# EAGLE design Thermocouple Testing (EAGLE 9.5.0)
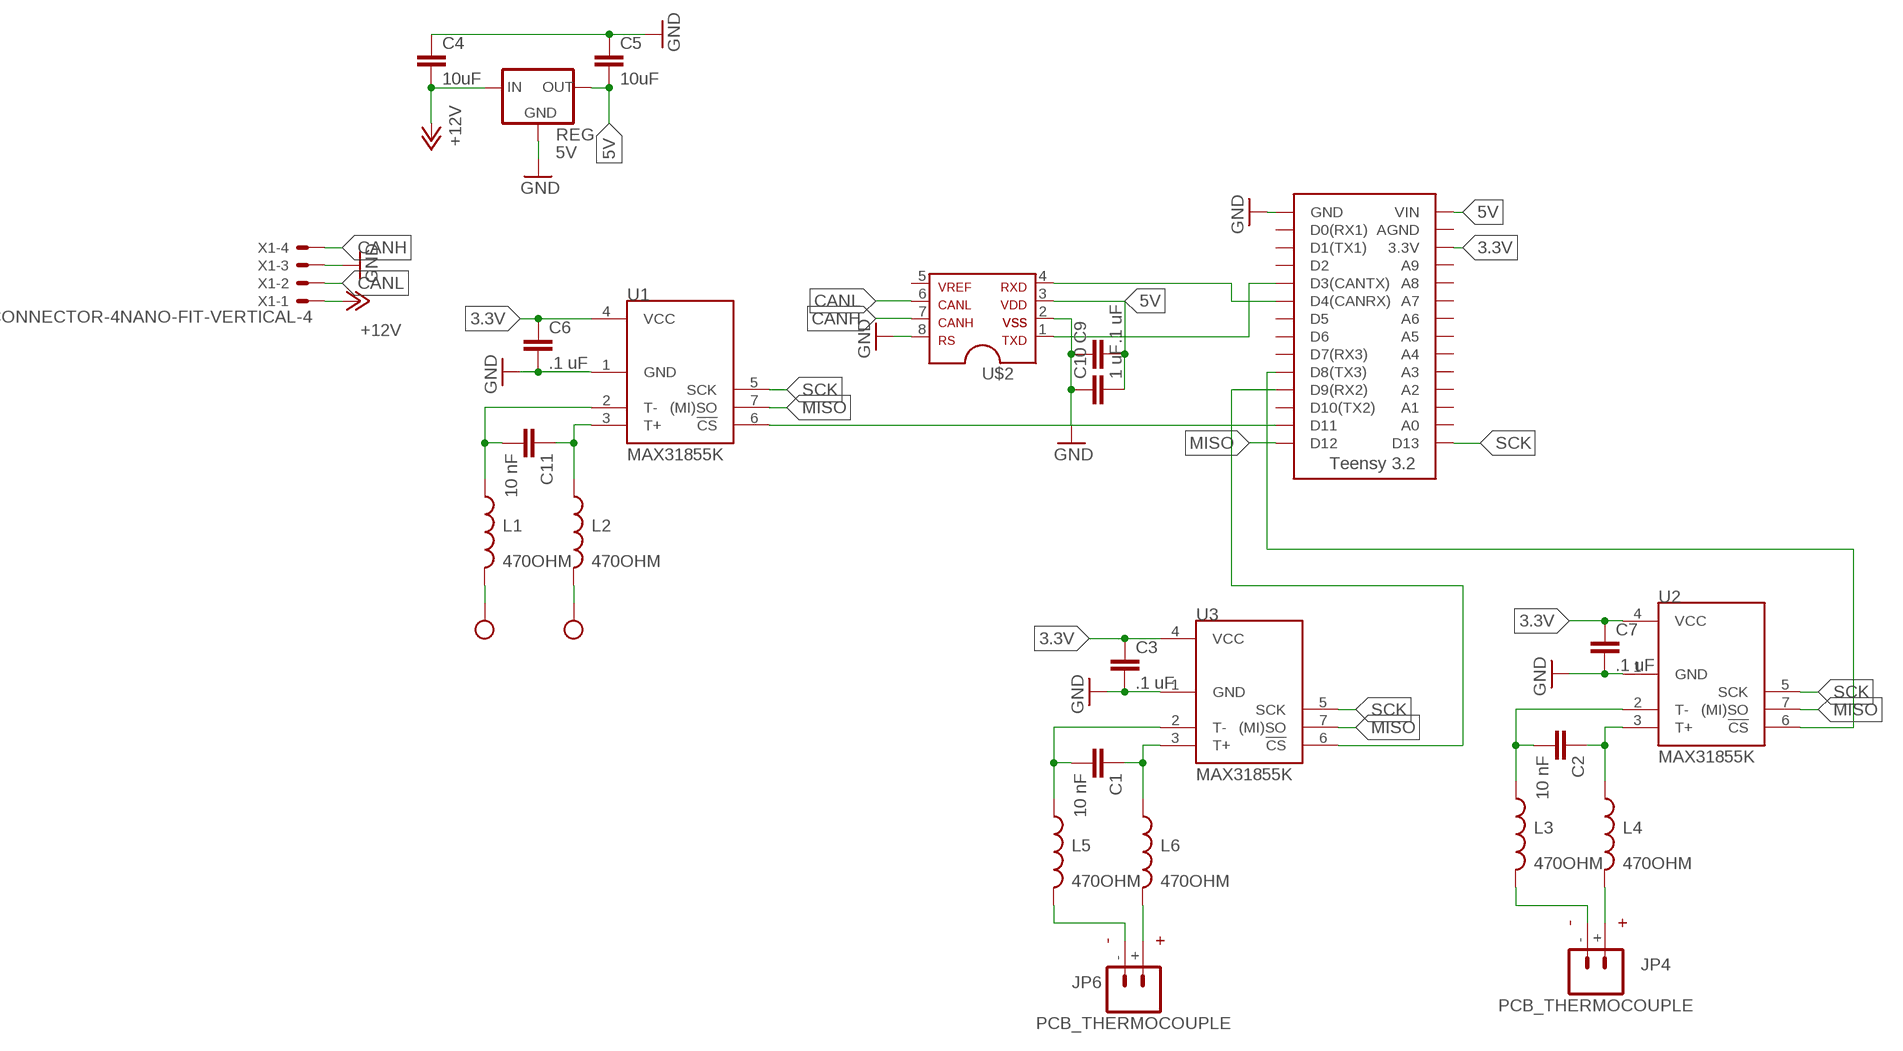
[diagram p0: schematic, sheet 1]

## Parts
C1  10 nF  CAP_  [AXIAL-5MM]
C2  10 nF  CAP_  [AXIAL-5MM]
C3  .1 uF  CAP_  [AXIAL-5MM]
C4  10uF  CAP_  [AXIAL-5MM]
C5  10uF  CAP_  [AXIAL-5MM]
C6  .1 uF  CAP_  [AXIAL-5MM]
C7  .1 uF  CAP_  [AXIAL-5MM]
C9  .1 uF  CAP_  [AXIAL-5MM]
C10  1 uF  CAP_  [AXIAL-5MM]
C11  10 nF  CAP_  [AXIAL-5MM]
JP4  PCB_THERMOCOUPLE  [PCC-SMP]
JP6  PCB_THERMOCOUPLE  [PCC-SMP]
L1  470OHM  INDUCTOR0805  [0805]
L2  470OHM  INDUCTOR0805  [0805]
L3  470OHM  INDUCTOR0805  [0805]
L4  470OHM  INDUCTOR0805  [0805]
L5  470OHM  INDUCTOR0805  [0805]
L6  470OHM  INDUCTOR0805  [0805]
REG  5V  OKI-78SR-5  [OKI-78SR]
U1  MAX31855K  [SOIC8]
U2  MAX31855K  [SOIC8]
U3  MAX31855K  [SOIC8]
U$1  TEENSY_3.2_SIMPLE  [TEENSY_3.2_SIMPLE]
U$2  MCP2551DIL  [DIL08]
U$3  TEST_POINT  [TEST_POINT]
U$4  TEST_POINT  [TEST_POINT]
X1  CONNECTOR-4NANO-FIT-VERTICAL-4  [NANO-FIT_VERTICAL-4]

## Nets
3.3V: C3.P$1 C6.P$1 C7.P$1 U1.4(VCC) U2.4(VCC) U3.4(VCC) U$1.3.3V
5V: C5.P$2 C9.P$2 C10.P$2 REG.3(OUT) U$1.VIN U$2.3
+12V: C4.P$2 REG.1(IN) X1.P$1
CANH: U$2.7 X1.P$4
CANL: U$2.6 X1.P$2
GND: C3.P$2 C4.P$1 C5.P$1 C6.P$2 C7.P$2 C9.P$1 C10.P$1 REG.2(GND) U1.1(GND) U2.1(GND) U3.1(GND) U$1.GND U$2.2 U$2.8 X1.P$3
MISO: U1.7((MI)SO) U2.7((MI)SO) U3.7((MI)SO) U$1.D12
N$1: L1.2 U$3.P$1
N$2: L2.2 U$4.P$1
N$3: C11.P$2 L1.1 U1.2(T-)
N$6: C2.P$1 L4.1 U2.3(T+)
N$7: C11.P$1 L2.1 U1.3(T+)
N$8: U1.6(!CS) U$1.D11
N$10: U3.6(!CS) U$1.D9(RX2)
N$11: U2.6(!CS) U$1.D8(TX3)
N$12: C2.P$2 L3.1 U2.2(T-)
N$13: JP4.- L3.2
N$14: JP4.+ L4.2
N$15: C1.P$1 L6.1 U3.3(T+)
N$16: U$1.D3(CANTX) U$2.1
N$17: U$1.D4(CANRX) U$2.4
N$19: C1.P$2 L5.1 U3.2(T-)
N$20: JP6.- L5.2
N$21: JP6.+ L6.2
SCK: U1.5(SCK) U2.5(SCK) U3.5(SCK) U$1.D13
Unconnected: JP4.CLIP1 JP4.CLIP2 JP6.CLIP1 JP6.CLIP2 U$1.A0 U$1.A1 U$1.A2 U$1.A3 U$1.A4 U$1.A5 U$1.A6 U$1.A7 U$1.A8 U$1.A9 U$1.AGND U$1.D0(RX1) U$1.D1(TX1) U$1.D2 U$1.D5 U$1.D6 U$1.D7(RX3) U$1.D10(TX2) U$2.5

## Library data of the parts
C1-C7 C9-C11 = HyTechDevices:CAP: Capacitor Standard 0603 ceramic capacitor, and 0.1" leaded capacitor.
JP4 JP6 = Testing:PCB_THERMOCOUPLE: Circuit Board Thermocouple Connectors Glass-Filled Nylon 220°C (425°F) The PCC connector from OMEGA is perfect for bringing thermocouple probes to printed circuit boards. (OMEGA PCC-SMP) For type-k thermocouples.
L1-L6 = SparkFun-Passives:INDUCTOR: Inductors Basic Inductor/Choke - 0603 and 1206. Footprints are not proven and vary greatly between part numbers. INDUCTOR POWER 3.3UH 4.0A SMD 0.197" L x 0.197" W x 0.177" H (5.00mm x 5.00mm x 4.50mm); PROD_ID: NDUC-12579
REG = HyTechDevices:OKI-78SR-5: Murata OKI-78SR 5V 1.5A Non-Isolated Switching Regulator DC/DC - Datasheet <https://power.murata.com/data/power/oki-78sr.pdf>
U1-U3 = SparkFun-AnalogIC:MAX31855K: Cold-Junction-Compensated K-Thermocoupleto-Digital Converter (-270°C to +1800°C) The MAX31855K performs cold-junction compensation and digitizes the signal from a type-K thermocouple. The data is output in a 14-bit resolution, SPI™-compatible, read-only format. This converter resolves temperatures to 0.25°C, allows readings as high as +1800°C and as low as -270°C, and exhibits thermocouple accuracy of ±2°C for temperatures ranging from -200°C to +700°C for K-type thermocouples.; PROD_ID: IC-12578
U$1 = HyTechDevices:TEENSY_3.2_SIMPLE: Simple version of the Teensy 3.2 board that only uses the 2 main rows of pins, not the inner pins or the pins opposite the usb port.
U$2 = HyTechDevices:MCP2551: MCP2551 High-Speed CAN Transceiver Product Webpage <https://www.microchip.com/wwwproducts/en/MCP2551> Datasheet <http://ww1.microchip.com/downloads/en/DeviceDoc/21667f.pdf> This device is outdated It is replaced by MCP2561. Comparison Page <https://www.microchip.com/wwwproducts/ProductCompare/MCP2551/MCP2561> Product Webpage <https://www.microchip.com/wwwproducts/en/MCP2561> Datasheet <http://ww1.microchip.com/downloads/en/DeviceDoc/20005167C.pdf>
U$3 U$4 = HyTechDevices:TEST_POINT: Keystone Electronics Test Point 5005
X1 = HyTechDevices:CONNECTOR-4: Mini-Fit Junior connector 4 pole Source: http://www.molex.com

## Board
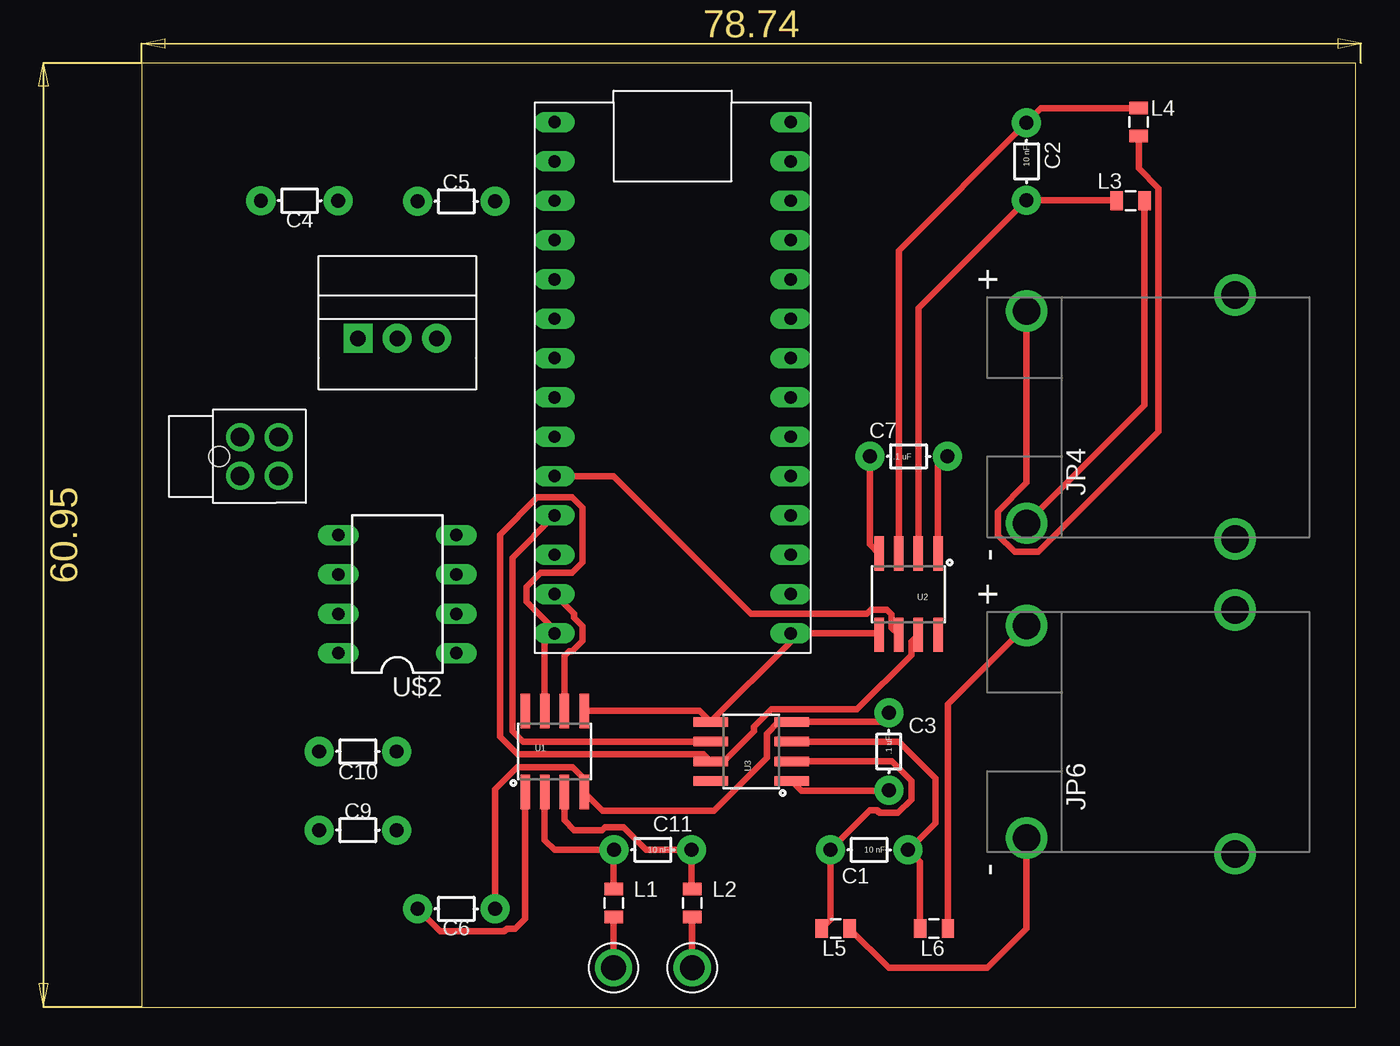
[diagram p1: board, top side]
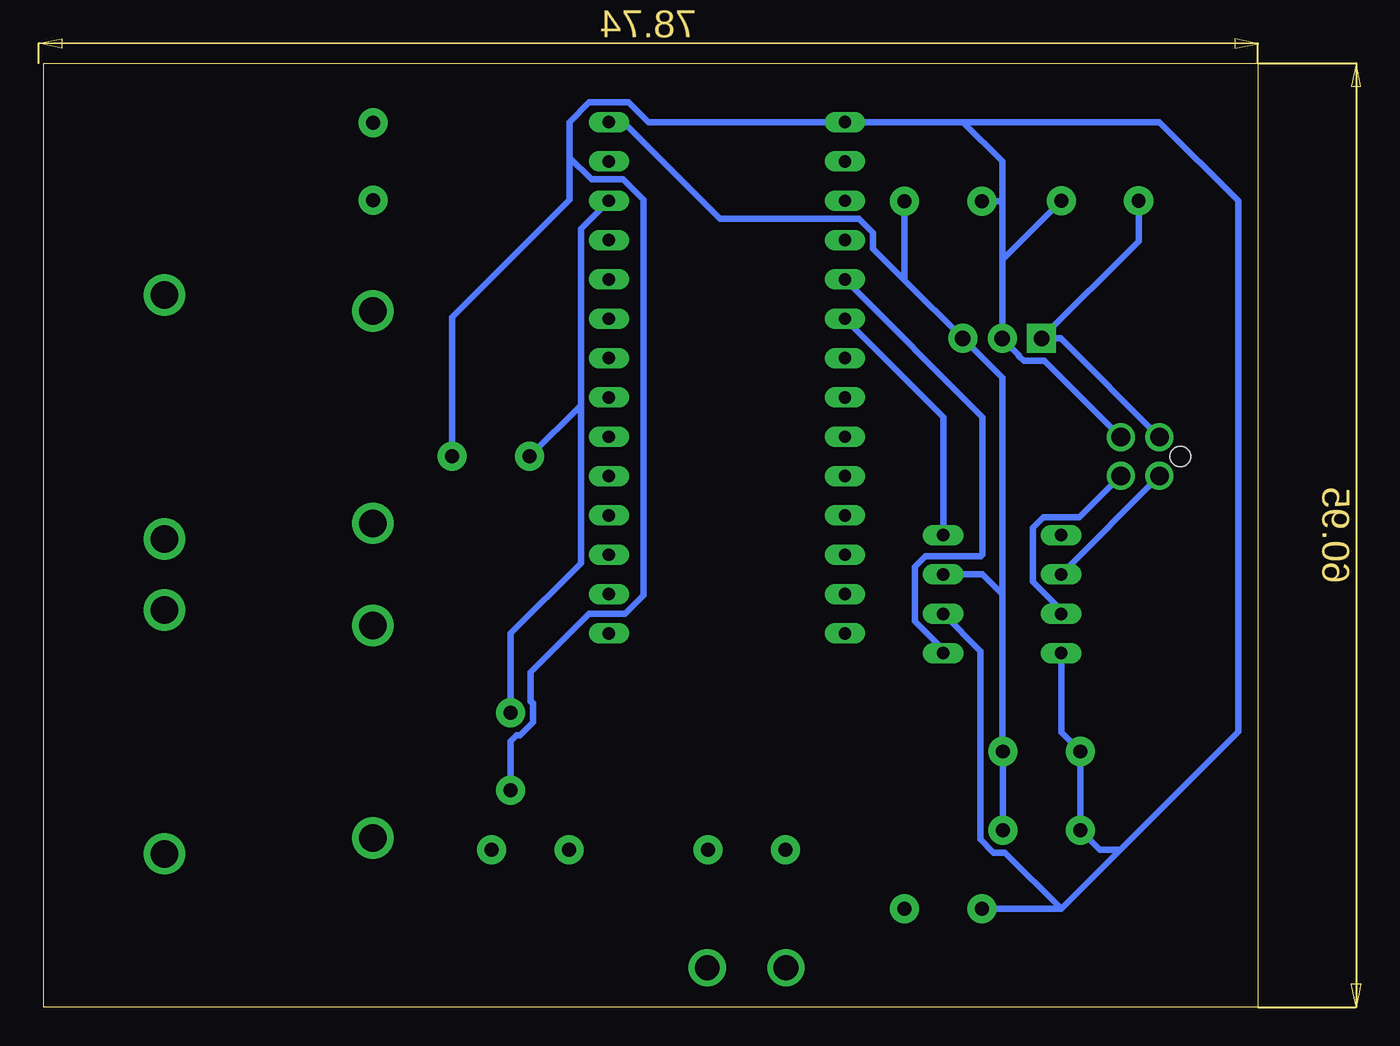
[diagram p2: board, bottom side, seen from below]

Size 78.41 x 60.95 mm. Coordinates in mm from the lower left corner, seen from the top.
Outline: 0,0 78.41,0 78.41,60.95 0,60.95 0,0
Copper layers (1*16): Top 0.035mm / dielectric 1.5mm / Bottom 0.035mm
Design rules "DRC Electronics Lab": minimum track width 16mil, minimum drill 19mil, track to track 16mil, track to pad 12mil, pad to pad 16mil, via to via 16mil, smd to smd 10mil, copper to edge 40mil, drill to drill 10mil, minimum pad ring 10mil, minimum via ring 8mil, stop-mask expansion 4mil, vias tented up to drill 0mil, thermal gap 10mil

### Footprints (pad centres in the part's own frame; a part is rotated, then mirrored left to right if it is on the bottom)
AXIAL-5MM = drill 0.9 pad 1.88: P$1 -2.5,0; P$2 2.5,0
PCC-SMP = drill 1.778: + 6.858,0; - -6.858,0; CLIP1 -7.874,-13.462; CLIP2 7.874,-13.462
0805 = smd 0.8 x 1.2: 1 -0.9,0; 2 0.9,0
OKI-78SR = drill 1 pad 1.88 square: 1 -2.54,0 | drill 1 pad 1.88: 2 0,0; 3 2.54,0
SOIC8 = smd 0.61 x 2.21: 1 -1.905,-2.616; 2 -0.635,-2.616; 3 0.635,-2.616; 4 1.905,-2.616; 5 1.905,2.616; 6 0.635,2.616; 7 -0.635,2.616; 8 -1.905,2.616
TEENSY_3.2_SIMPLE = drill 0.8 long: 3.3V 16.51,29.21; A0 16.51,3.81; A1 16.51,6.35; A2 16.51,8.89; A3 16.51,11.43; A4 16.51,13.97; A5 16.51,16.51; A6 16.51,19.05; A7 16.51,21.59; A8 16.51,24.13; A9 16.51,26.67; AGND 16.51,31.75; D0(RX1) 1.27,31.75; D1(TX1) 1.27,29.21; D2 1.27,26.67; D3(CANTX) 1.27,24.13; D4(CANRX) 1.27,21.59; D5 1.27,19.05; D6 1.27,16.51; D7(RX3) 1.27,13.97; D8(TX3) 1.27,11.43; D9(RX2) 1.27,8.89; D10(TX2) 1.27,6.35; D11 1.27,3.81; D12 1.27,1.27; D13 16.51,1.27; GND 1.27,34.29; VIN 16.51,34.29
DIL08 = drill 0.813 long: 1 -3.81,-3.81; 2 -1.27,-3.81; 3 1.27,-3.81; 4 3.81,-3.81; 5 3.81,3.81; 6 1.27,3.81; 7 -1.27,3.81; 8 -3.81,3.81
TEST_POINT = drill 1.6: P$1 0,0
NANO-FIT_VERTICAL-4 = drill 1.2: P$1 -1.25,0; P$2 1.25,0; P$3 -1.25,2.5; P$4 1.25,2.5 | hole 1.3: 0,-1.34

### Placement (x,y rotation side)
C1  46.99,10.16 180 top
C2  57.15,54.61 270 top
C3  48.26,16.51 270 top
C4  10.2,52.07 180 top
C5  20.32,52.03 0 top
C6  20.32,6.35 180 top
C7  49.53,35.56 0 top
C9  13.97,11.43 0 top
C10  13.97,16.51 0 top
C11  33.02,10.16 180 top
JP4  57.15,38.1 90 top
JP6  57.15,17.78 90 top
L1  30.48,6.72 270 top
L2  35.56,6.72 270 top
L3  63.87,52.07 0 top
L4  64.4,57.15 270 top
L5  44.82,5.08 0 top
L6  51.17,5.08 0 top
REG  16.51,43.18 0 top
U1  26.67,16.51 0 top
U2  49.53,26.67 180 top
U3  39.37,16.51 90 top
U$1  25.4,22.86 0 top
U$2  16.51,26.67 90 top
U$3  30.48,2.54 0 top
U$4  35.56,2.54 0 top
X1  6.35,35.56 270 top

### Tracks (layer width: path | path; a pad name or v marks a point on that pad's centre or on a via)
3.3V
  Top 0.406: U2.4 47.03,29.88 C7.P$1 | C3.P$1 47.66,18.41 U3.4 41.13,18.41 40.37,17.66 40.37,16.1 36.98,12.7 29.77,12.7 U1.4 28.57,14.75 27.82,15.51 24.25,15.51 22.82,14.08 C6.P$1
  Bottom 0.406: U$1.3.3V 43.73,50.25 43.73,38.86 | C3.P$1 48.26,24.13 43.73,28.66 43.73,38.86 | C7.P$1 43.73,38.86
5V
  Bottom 0.406: C9.P$2 C10.P$2 16.51,16.55 16.51,26.67 | C5.P$2 22.82,46.95 | 22.82,46.95 REG.3 16.51,40.64 16.51,26.67 | 16.51,26.67 17.78,27.94 U$2.3 | U$1.VIN 40.98,57.15 34.74,50.91 25.75,50.91 24.85,50.01 24.85,48.98 22.82,46.95
+12V
  Bottom 0.406: C4.P$2 7.7,49.45 REG.1 12.72,43.18 X1.P$1
CANH
  Bottom 0.406: X1.P$4 11.51,31.65 13.84,31.65 14.53,30.96 14.53,27.46 12.7,25.63 U$2.7
CANL
  Bottom 0.406: X1.P$2 12.7,27.96 U$2.6
GND
  Top 0.406: U2.1 51.44,34.97 C7.P$2 | U3.1 42.62,13.97 48.22,13.97 C3.P$2 | C6.P$2 19.27,4.9 23.42,4.9 23.6,5.08 24.13,5.08 24.77,5.71 U1.1
  Bottom 0.406: 16.51,48.26 REG.2 15.42,42.09 15.42,42.03 15.12,41.73 13.77,41.73 X1.P$3 | C4.P$1 16.51,48.26 | 16.51,48.26 16.51,52.03 | 16.51,52.03 16.51,54.61 19.05,57.15 | 19.05,57.15 U$1.GND 39.37,57.15 40.64,58.42 43.18,58.42 44.45,57.15 44.45,54.85 | C5.P$1 16.51,52.03 | C6.P$2 12.7,6.35 | 19.05,57.15 6.35,57.15 1.27,52.07 1.27,17.78 8.89,10.16 | 12.7,6.35 8.89,10.16 | C7.P$2 52.03,44.55 44.45,52.13 44.45,54.85 | U$2.8 12.7,17.74 C10.P$1 C9.P$1 10.2,10.16 8.89,10.16 | C3.P$2 48.26,17.18 47.88,17.56 47.66,17.56 46.81,18.41 46.81,19.61 46.97,19.76 46.97,21.61 43.18,25.4 40.88,25.4 39.69,26.59 39.69,52.15 40.99,53.45 43.05,53.45 44.45,54.85 | U$2.2 17.92,23 17.92,10.83 17.07,9.98 16.33,9.98 12.7,6.35
MISO
  Top 0.406: U1.7 26.04,23.5 U$1.D12 26.67,24.37 24.85,26.19 24.85,27.15 25.75,28.05 27.8,28.05 28.49,28.73 28.49,32.23 27.8,32.91 25.54,32.91 23.14,30.52 23.14,17.47 24.28,16.33 36.3,16.33 U3.7 37.61,15.88 39.56,17.82 39.56,18.12 40.67,19.23 46.2,19.23 49.71,22.74 49.71,23.6 U2.7
N$1
  Top 0.406: L1.2 U$3.P$1
N$2
  Top 0.406: L2.2 U$4.P$1
N$3
  Top 0.406: L1.1 30.48,10.12 C11.P$2 26.67,10.16 26.04,10.79 U1.2
N$6
  Top 0.406: U2.3 48.9,48.85 C2.P$1 58.09,58.05 L4.1
N$7
  Top 0.406: L2.1 35.52,7.66 C11.P$1 32.57,10.16 31.12,11.61 29.92,11.61 29.74,11.43 27.94,11.43 27.3,12.06 U1.3
N$8
  Top 0.406: U1.6 27.3,22.68 27.59,22.97 27.8,22.97 28.49,23.65 28.49,24.61 27.94,25.16 27.94,25.4 U$1.D11
N$10
  Top 0.406: U3.6 24.62,17.14 23.95,17.81 23.95,29.03 U$1.D9(RX2)
N$11
  Top 0.406: U$1.D8(TX3) 30.48,34.29 39.37,25.4 46.84,25.4 47.11,25.67 48.14,25.67 48.44,25.37 48.44,24.51 U2.6
N$12
  Top 0.406: U2.2 50.16,45.12 C2.P$2 62.93,52.11 L3.1
N$13
  Top 0.406: L3.2 64.77,38.86 JP4.-
N$14
  Top 0.406: L4.2 64.4,54.16 65.68,52.88 65.68,37.17 57.91,29.4 56.39,29.4 55.31,30.48 55.31,32.01 57.15,33.85 JP4.+
N$15
  Top 0.406: C1.P$1 49.51,10.14 | 49.51,10.14 50.27,9.38 L6.1 | U3.3 48.9,17.14 51.26,14.78 51.26,11.89 49.51,10.14
N$16
  Bottom 0.406: U$1.D3(CANTX) 17.78,38.1 17.78,29.21 17.88,29.11 21.46,29.11 22.15,28.42 22.15,24.92 20.32,23.09 U$2.1
N$17
  Bottom 0.406: U$2.4 20.32,38.1 U$1.D4(CANRX)
N$19
  Top 0.406: L5.1 44.49,5.65 C1.P$2 47.05,12.71 47.51,12.71 47.66,12.56 48.86,12.56 49.71,13.41 49.71,14.61 48.44,15.88 U3.2
N$20
  Top 0.406: L5.2 48.26,2.54 54.61,2.54 57.15,5.08 JP6.-
N$21
  Top 0.406: L6.2 52.07,19.56 JP6.+
SCK
  Top 0.406: U1.5 36.04,19.13 U3.5 41.91,23.57 U$1.D13 47.55,24.13 U2.5